# Altium schematic sheet Main Schematic.SchDoc
size A4
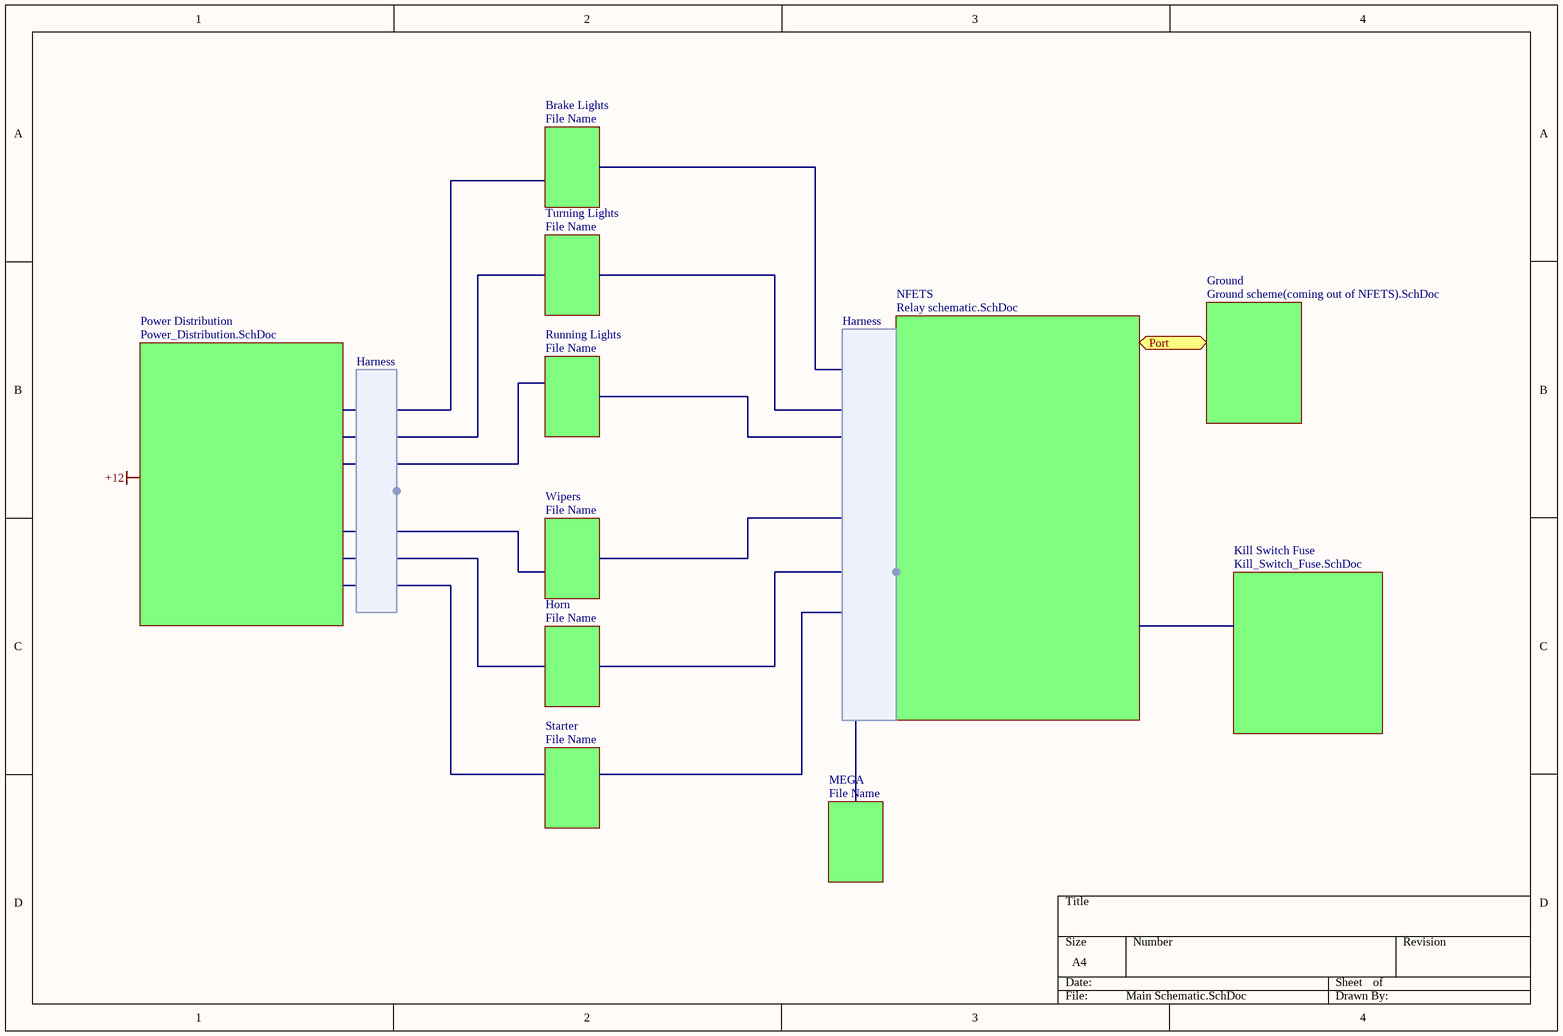
[diagram p0: Main Schematic.SchDoc]

## Sub-sheets
Brake Lights = File Name: no entries
Ground = Ground scheme(coming out of NFETS).SchDoc: no entries
Horn = File Name: no entries
Kill Switch Fuse = Kill_Switch_Fuse.SchDoc: no entries
MEGA = File Name: no entries
NFETS = Relay schematic.SchDoc: no entries
Power Distribution = Power_Distribution.SchDoc: no entries
Running Lights = File Name: no entries
Starter = File Name: no entries
Turning Lights = File Name: no entries
Wipers = File Name: no entries

## Ports
Port

## Harnesses
Harness: 

## Notes on the sheet
- Labels drawn without touching a wire or pin: +12